# EAGLE design thefly (EAGLE 7.6.0)
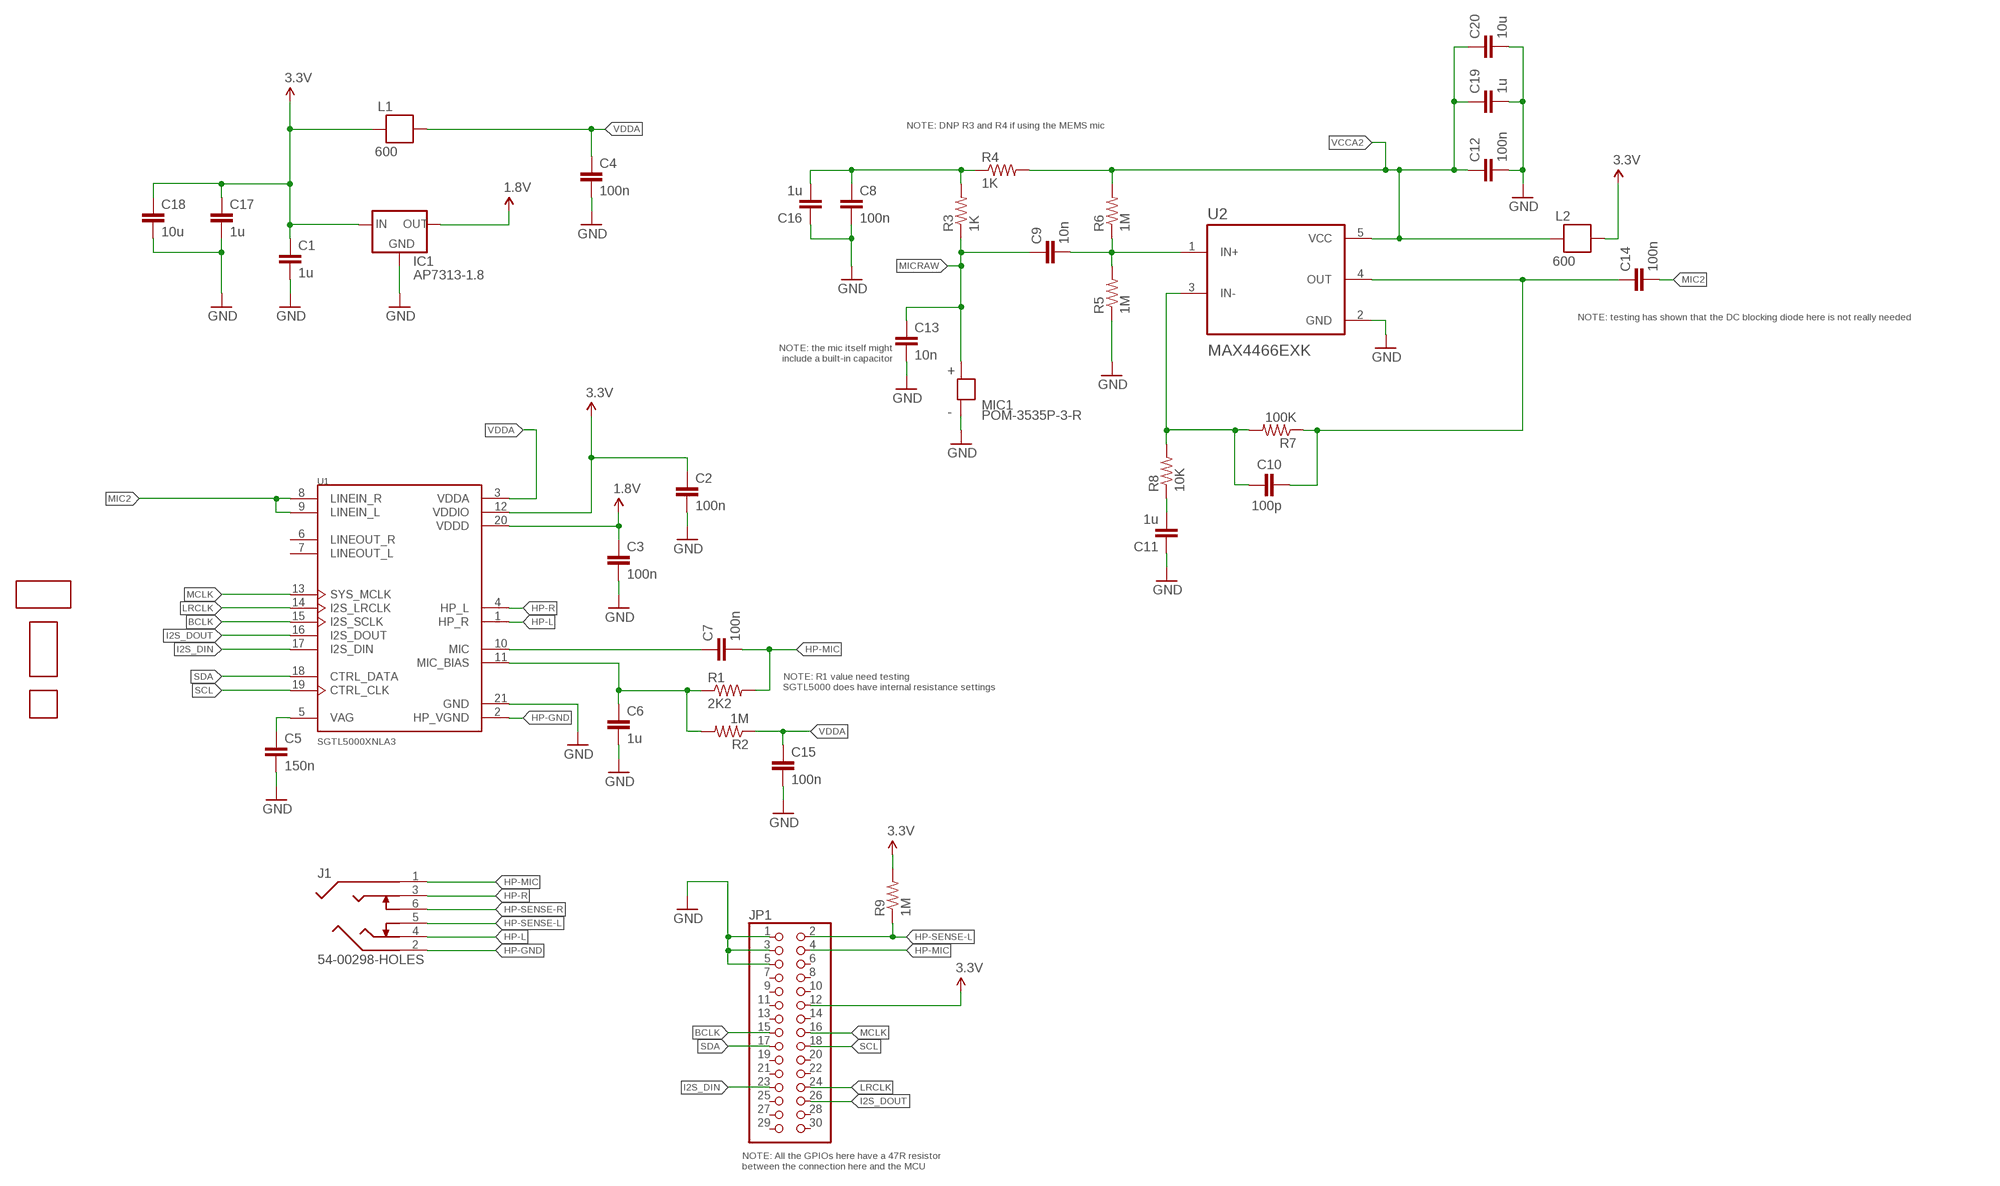
[diagram p0: schematic, sheet 1]

## Parts
C1  1u  CAP0603-CAP  [0603-CAP]
C2  100n  CAP0603-CAP  [0603-CAP]
C3  100n  CAP0603-CAP  [0603-CAP]
C4  100n  CAP0603-CAP  [0603-CAP]
C5  150n  CAP0603-CAP  [0603-CAP]
C6  1u  CAP0603-CAP  [0603-CAP]
C7  100n  CAP0603-CAP  [0603-CAP]
C8  100n  CAP0603-CAP  [0603-CAP]
C9  10n  CAP0603-CAP  [0603-CAP]
C10  100p  CAP0603-CAP  [0603-CAP]
C11  1u  CAP0603-CAP  [0603-CAP]
C12  100n  CAP0603-CAP  [0603-CAP]
C13  10n  CAP0603-CAP  [0603-CAP]
C14  100n  CAP0603-CAP  [0603-CAP]
C15  100n  CAP0603-CAP  [0603-CAP]
C16  1u  CAP0603-CAP  [0603-CAP]
C17  1u  CAP0603-CAP  [0603-CAP]
C18  10u  CAP0603-CAP  [0603-CAP]
C19  1u  CAP0603-CAP  [0603-CAP]
C20  10u  CAP0603-CAP  [0603-CAP]
IC1  AP7313-1.8  V_REG_78XX-SOT23-3  [SOT23-3]
J1  54-00298-HOLES  [TENSILITY_54-00298_HOLES]
JP1  PINHD-2X15-SMD-R  [2X15-SMD-R]
L1  600  FB  [0603]
L2  600  FB  [0603]
MIC1  POM-3535P-3-R  [MIC_POM-3535P-3-R]
R1  2K2  RESISTOR0603-RES  [0603-RES]
R2  1M  RESISTOR0603-RES  [0603-RES]
R3  1K  RESISTOR0603-RES  [0603-RES]
R4  1K  RESISTOR0603-RES  [0603-RES]
R5  1M  RESISTOR0603-RES  [0603-RES]
R6  1M  RESISTOR0603-RES  [0603-RES]
R7  100K  RESISTOR0603-RES  [0603-RES]
R8  10K  RESISTOR0603-RES  [0603-RES]
R9  1M  RESISTOR0603-RES  [0603-RES]
U1  SGTL5000XNLA3  [QFN40P300X300X60-21N]
U2  MAX4466EXK  [SOT65P210X110-5N]
U$1  M5STACK-CORE2-DAUGHTER  [M5STACK-CORE2-DAUGHTER]
U$2  M5STACK-BATT-OUTLINE  [M5STACK-BATT-OUTLINE]
U$5  THE-FLY-LOGO  [THE-FLY-LOGO]

## Nets
1.8V: C3.1 IC1.2(OUT) U1.20(VDDD)
3.3V: C1.1 C2.1 C17.1 C18.1 IC1.1(IN) JP1.12 L1.2 L2.1 R9.2 U1.12(VDDIO)
ASDASDASD: C10.2 C14.1 R7.1 U2.4(OUT)
BCLK: JP1.15 U1.15(I2S_SCLK)
GND: C1.2 C2.2 C3.2 C4.2 C5.2 C6.2 C8.2 C11.1 C12.2 C13.2 C15.2 C16.1 C17.2 C18.2 C19.2 C20.2 IC1.3(GND) JP1.1 JP1.3 JP1.5 MIC1.N(-) R5.1 U1.21(GND) U2.2(GND)
HP-GND: J1.2 U1.2(HP_VGND)
HP-L: J1.4 U1.1(HP_R)
HP-MIC: C7.2 J1.1 JP1.4 R1.2
HP-R: J1.3 U1.4(HP_L)
HP-SENSE-L: J1.5 JP1.2 R9.1
HP-SENSE-R: J1.6
I2S_DIN: JP1.23 U1.17(I2S_DIN)
I2S_DOUT: JP1.26 U1.16(I2S_DOUT)
LRCLK: JP1.24 U1.14(I2S_LRCLK)
MCLK: JP1.16 U1.13(SYS_MCLK)
MIC2: C14.2 U1.8(LINEIN_R) U1.9(LINEIN_L)
MICRAW: C9.1 C13.1 MIC1.P(+) R3.1
N$3: C5.1 U1.5(VAG)
N$4: C6.1 R1.1 R2.2 U1.11(MIC_BIAS)
N$5: C7.1 U1.10(MIC)
N$6: C10.1 R7.2 R8.2 U2.3(IN-)
N$8: C11.2 R8.1
N$9: C9.2 R5.2 R6.1 U2.1(IN+)
N$11: C8.1 C16.2 R3.2 R4.1
SCL: JP1.18 U1.19(CTRL_CLK)
SDA: JP1.17 U1.18(CTRL_DATA)
VCCA2: C12.1 C19.1 C20.1 L2.2 R4.2 R6.2 U2.5(VCC)
VDDA: C4.1 C15.1 L1.1 R2.1 U1.3(VDDA)
Unconnected: JP1.6 JP1.7 JP1.8 JP1.9 JP1.10 JP1.11 JP1.13 JP1.14 JP1.19 JP1.20 JP1.21 JP1.22 JP1.25 JP1.27 JP1.28 JP1.29 JP1.30 U1.6(LINEOUT_R) U1.7(LINEOUT_L)

## Notes on the sheet
- NOTE: DNP R3 and R4 if using the MEMS mic
- NOTE: testing has shown that the DC blocking diode here is not really needed
- NOTE: the mic itself might
  include a built-in capacitor
- NOTE: R1 value need testing
  SGTL5000 does have internal resistance settings
- NOTE: All the GPIOs here have a 47R resistor
  between the connection here and the MCU

## Library data of the parts
C1-C20 = thefly:CAP: Capacitor Standard 0603 ceramic capacitor, and 0.1" leaded capacitor.
IC1 = thefly:V_REG_78XX: Voltage Regulator Standard 7805 5V regulator. IGO (Input Ground Output). Spark Fun Electronics SKU : COM-00107
J1 = thefly:54-00298
JP1 = thefly:PINHD-2X15: PIN HEADER
L1 L2 = thefly:FB
MIC1 = thefly:POM-3535P-3-R; CHECK_PRICES: https://www.snapeda.com/parts/POM-3535P-3-R/PUI+Audio/view-part/?ref=eda; DESCRIPTION: 6MM ECM MIC 20~20000HZ 35DB 2V 0.5MA IP52 OMNIDIRECTIONAL; DIGIKEY_PART_NUMBER: 668-1425-ND; MF: PUI Audio; MP: POM-3535P-3-R; PACKAGE: None; SNAPEDA_LINK: https://www.snapeda.com/parts/POM-3535P-3-R/PUI+Audio/view-part/?ref=snap
R1-R9 = thefly:RESISTOR: Resistor Basic schematic elements and footprints for 0603, 1206, and PTH resistors.
U1 = thefly:SGTL5000XNLA3: Check availability <https://pricing.snapeda.com/parts/SGTL5000XNLA3/NXP%20Semiconductors/view-part?ref=eda>; AVAILABILITY: In Stock; CHECK_PRICES: https://www.snapeda.com/parts/SGTL5000XNLA3/NXP+Semiconductors/view-part/?ref=eda; DESCRIPTION: Stereo Audio Interface - I²C, Serial, SPI™ 20-QFN-EP (3x3); MF: NXP Semiconductors; MP: SGTL5000XNLA3; PACKAGE: QFN-20 Freescale Semiconductor; PRICE: None; PURCHASE-URL: https://www.snapeda.com/api/url_track_click_mouser/?unipart_id=4792388&manufacturer=NXP Semiconductors&part_name=SGTL5000XNLA3&search_term=sgtl5000; SNAPEDA_LINK: https://www.snapeda.com/parts/SGTL5000XNLA3/NXP+Semiconductors/view-part/?ref=snap
U2 = thefly:MAX4466EXK; CHECK_PRICES: https://www.snapeda.com/parts/MAX4466EXK+T/Maxim+Integrated/view-part/?ref=eda; DESCRIPTION: Audio Amp Microphone 1-CH Mono Class-AB 5-Pin SC-70 T/R; DIGIKEY_PART_NUMBER: MAX4466EXK+CT-ND; MF: Maxim Integrated Products; MP: MAX4466EXK+T; PACKAGE: SC-70-5 Maxim; PURCHASE-URL: https://www.snapeda.com/api/url_track_click_mouser/?unipart_id=13771026&manufacturer=Maxim Integrated Products&part_name=MAX4466EXK+T&search_term=max4466; SNAPEDA_LINK: https://www.snapeda.com/parts/MAX4466EXK+T/Maxim+Integrated/view-part/?ref=snap
U$1 = thefly:M5STACK-CORE2-DAUGHTER
U$2 = thefly:M5STACK-BATT-OUTLINE
U$5 = thefly:THE-FLY-LOGO

## Board
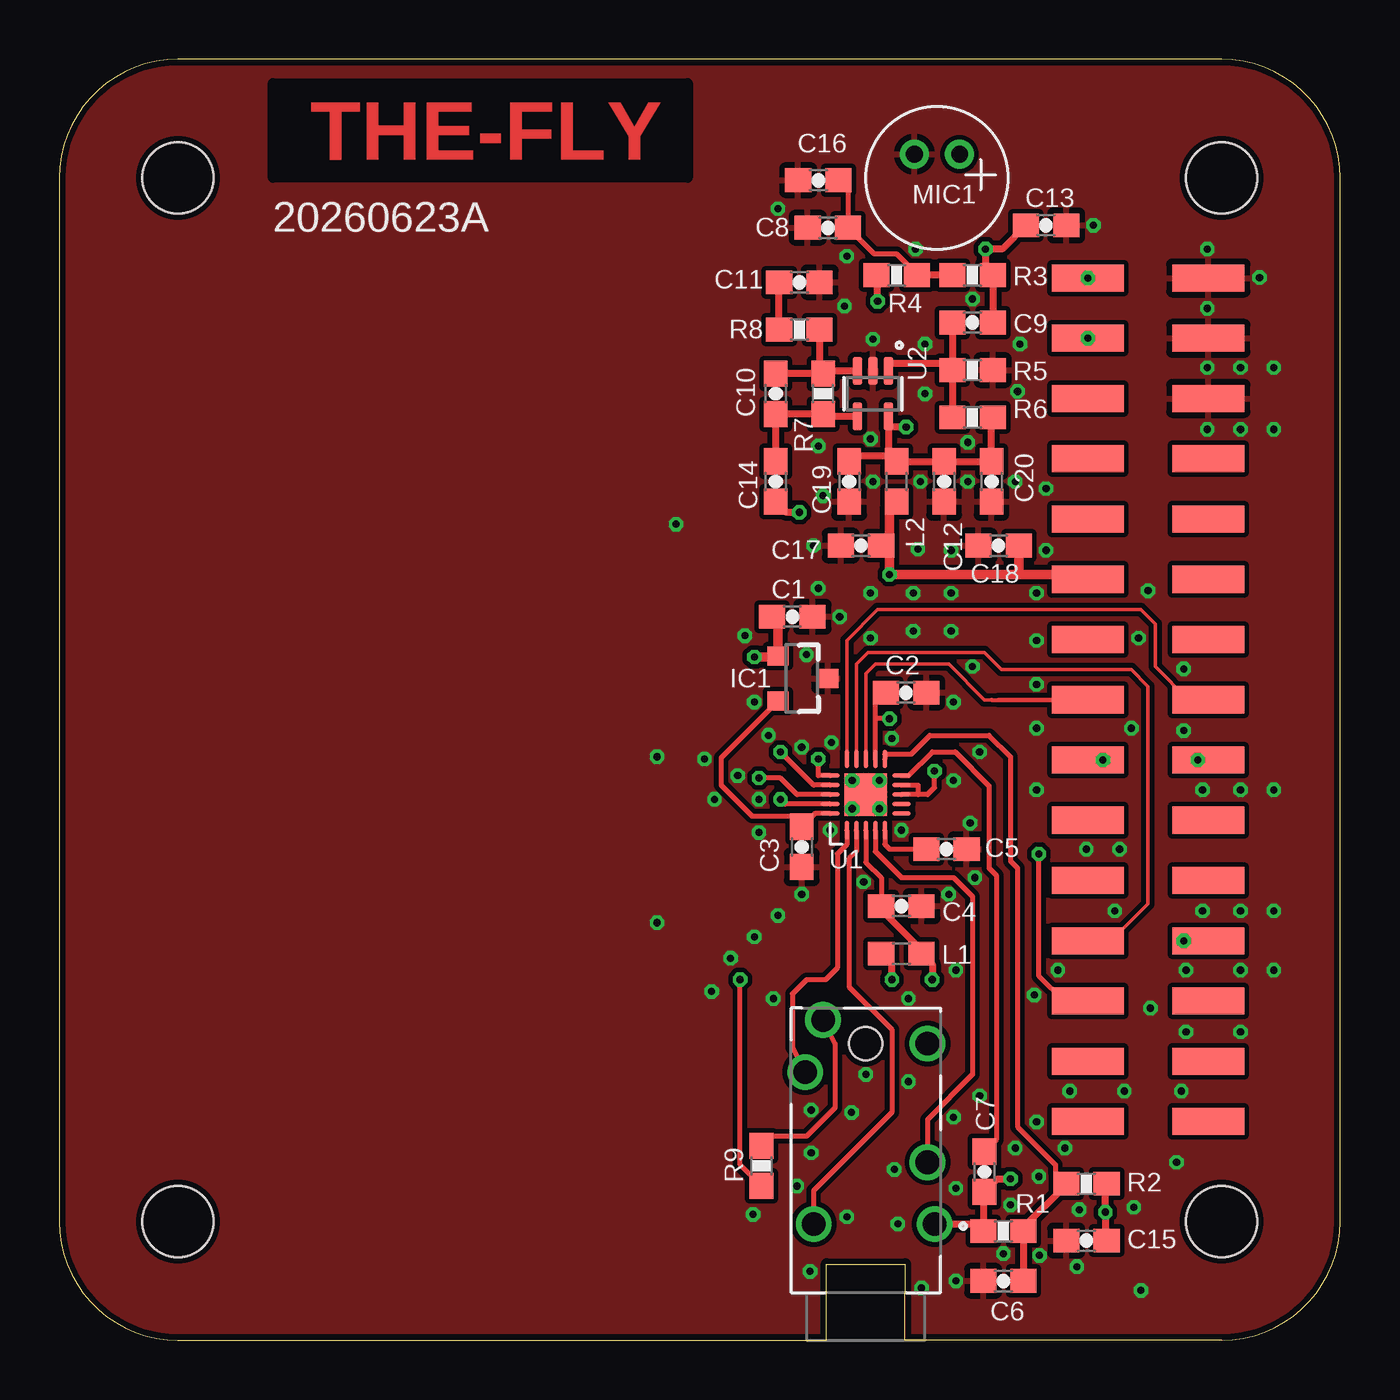
[diagram p1: board, top side]
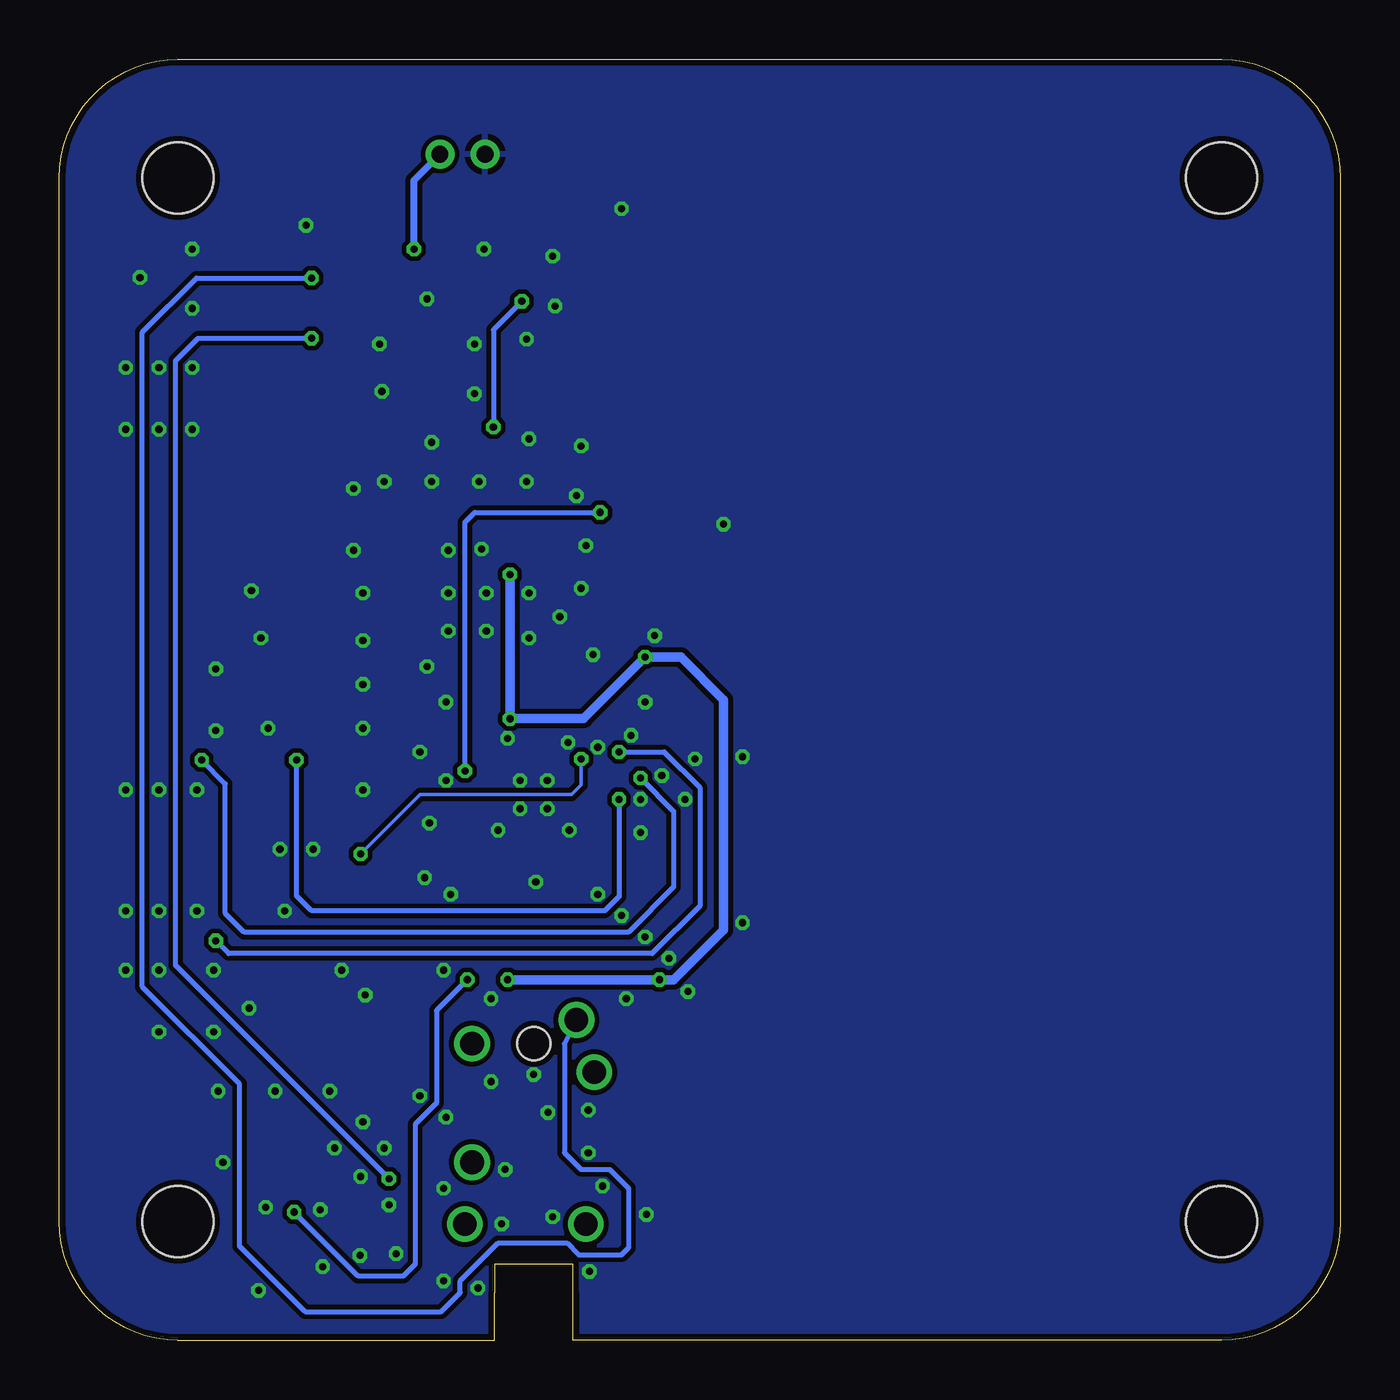
[diagram p2: board, bottom side, seen from below]

Size 54 x 54 mm. Coordinates in mm from the lower left corner, seen from the top.
Outline: 5,0 32.35,0 32.35,2
Outline: 49,0 35.65,0 35.65,2
Copper layers (1*16): Top 0.035mm / dielectric 1.5mm / Bottom 0.035mm
Design rules "fusion-eagle-rule-tentedvias": minimum track width 6mil, minimum drill 0.3mm, track to track 6mil, track to pad 6mil, pad to pad 6mil, via to via 6mil, smd to smd 0mil, copper to edge 10mil, drill to drill 10mil, minimum pad ring 10mil, minimum via ring 6mil, stop-mask expansion 2mil, vias tented up to drill 25mil, thermal gap 10mil

### Footprints (pad centres in the part's own frame; a part is rotated, then mirrored left to right if it is on the bottom)
0603-CAP = smd 1.1 x 1: 1 -0.85,0; 2 0.85,0
SOT23-3 = smd 0.8 x 0.9: 1 -0.95,-1; 2 0.95,-1; 3 0,1.1
TENSILITY_54-00298_HOLES = drill 1: 1 2.9,-2.1; 2 -2.2,-2.1; 3 2.6,0.5; 4 -2.55,4.3; 5 -1.8,6.5; 6 2.6,5.5 | hole 1.4: 0,5.5
2X15-SMD-R = smd 1.143 x 3.048: 1 -17.78,2.54; 2 -17.78,-2.54; 3 -15.24,2.54; 4 -15.24,-2.54; 5 -12.7,2.54; 6 -12.7,-2.54; 7 -10.16,2.54; 8 -10.16,-2.54; 9 -7.62,2.54; 10 -7.62,-2.54; 11 -5.08,2.54; 12 -5.08,-2.54; 13 -2.54,2.54; 14 -2.54,-2.54; 15 0,2.54; 16 0,-2.54; 17 2.54,2.54; 18 2.54,-2.54; 19 5.08,2.54; 20 5.08,-2.54; 21 7.62,2.54; 22 7.62,-2.54; 23 10.16,2.54; 24 10.16,-2.54; 25 12.7,2.54; 26 12.7,-2.54; 27 15.24,2.54; 28 15.24,-2.54; 29 17.78,2.54; 30 17.78,-2.54
0603 = smd 1.1 x 1: 1 -0.85,0; 2 0.85,0
MIC_POM-3535P-3-R = drill 0.7: N -0.95,1; P 0.95,1
0603-RES = smd 1.1 x 1: 1 -0.85,0; 2 0.85,0
QFN40P300X300X60-21N = smd 0.8 x 0.2: 1 -1.5,0.8; 2 -1.5,0.4; 3 -1.5,0; 4 -1.5,-0.4; 5 -1.5,-0.8; 11 1.5,-0.8; 12 1.5,-0.4; 13 1.5,0; 14 1.5,0.4; 15 1.5,0.8 | smd 0.2 x 0.8: 6 -0.8,-1.5; 7 -0.4,-1.5; 8 0,-1.5; 9 0.4,-1.5; 10 0.8,-1.5; 16 0.8,1.5; 17 0.4,1.5; 18 0,1.5; 19 -0.4,1.5; 20 -0.8,1.5 | smd 1.8 x 1.8: 21 0,0
SOT65P210X110-5N = smd 1.19 x 0.4: 1 -0.96,0.65; 2 -0.96,0; 3 -0.96,-0.65; 4 0.96,-0.65; 5 0.96,0.65
M5STACK-CORE2-DAUGHTER = hole 3: 5,5; 49,5; 49,49; 5,49

### Placement (x,y rotation side)
C1  30.9,30.5 0 top
C2  35.7,27.3 0 top
C3  31.3,20.8 270 top
C4  35.5,18.3 0 top
C5  37.4,20.7 0 top
C6  39.8,2.5 180 top
C7  39,7.1 270 top
C8  32.4,46.9 180 top
C9  38.5,42.9 180 top
C10  30.2,39.9 270 top
C11  31.2,44.6 180 top
C12  37.3,36.2 270 top
C13  41.6,47 0 top
C14  30.2,36.2 270 top
C15  43.3,4.2 180 top
C16  32,48.9 0 top
C17  33.8,33.5 180 top
C18  39.6,33.5 180 top
C19  33.3,36.2 270 top
C20  39.3,36.2 270 top
IC1  31.3,27.9 270 top
J1  34,7 0 top
JP1  45.9,27 270 top
L1  35.5,16.3 180 top
L2  35.3,36.2 90 top
MIC1  37,49 0 top
R1  39.8,4.6 180 top
R2  43.3,6.6 180 top
R3  38.5,44.9 180 top
R4  35.3,44.9 180 top
R5  38.5,40.9 180 top
R6  38.5,38.9 0 top
R7  32.2,39.9 90 top
R8  31.2,42.6 0 top
R9  29.6,7.35 270 top
U1  34,23 90 top
U2  34.3,39.9 270 top
U$1  0,0 0 top
U$2  4,9 0 top
U$5  18,51 0 top

### Tracks (layer width: path | path; a pad name or v marks a point on that pad's centre or on a via)
1.8V
  Top 0.203: U1.20 31.85,22.2 C3.1 | 31.25,21.6 C3.1 | IC1.2 27.9,24.55 27.9,23.4 29.2,22.1 31.3,22.1 C3.1
3.3V  (via drill 0.3)
  Top 0.203: U1.12 34.4,26.2 | C2.1 34.4,26.85 34.4,26.2 | v35,26.2 34.4,26.2 | R9.2 28.7,7.4 v28.7,15.2
  Top 0.305: v35.1,15.2 35.1,15.85 L1.2
  Top 0.406: v29.3,28.8 30.25,28.8 IC1.1 30.3,30.5 C1.1 | JP1.12 43.36,32.28 40.45,32.28 | 40.45,32.28 v35,32.28 35,33.5 | C18.1 40.45,32.28 | L2.1 35,35.05 35,34 35,33.5 | C17.1 35,33.5
  Bottom 0.406: v35.1,15.2 v28.7,15.2 28.1,15.2 26,17.3 26,27 27.8,28.8 v29.3,28.8 31.9,26.2 v35,26.2 v35,32.28
ASDASDASD
  Top 0.203: 32.21,38.94 R7.1
  Top 0.305: U2.4 32.21,38.94 | R7.1 C10.2 C14.1
BCLK
  Top 0.152: U1.15 33.2,29.5 34.5,30.8 45.6,30.8 46.2,30.2 46.2,28.4 47.6,27 JP1.15
GND  (via drill 0.3)
  Top 0.203: v34.58,22.41 34.58,23 U1.21
  other vias: 33.42,23.59 34.58,23.59 33.42,22.41 40.3,8.1 40.1,5.7 38.8,24.8 35.1,25.38 37.7,26.9 32.5,21.5 35.5,21.5 31.3,18.8 37.5,18.8 38.6,19.5 38.4,21.8 29.5,22.8 28.6,23.8 32.55,25.2 29.5,21.4 29.9,25.5 29.3,26.9 31.5,28.9 32.9,30.5 28.9,29.7 27.62,22.8 27.2,24.5 30.3,17.9 43.3,20.7 44.7,20.7 45.2,25.8 41.2,23.2 41.2,25.8 41.2,29.5 36,29.9 34.2,29.6 37.6,29.9 37.6,31.5 36,31.5 34.2,31.5 45.9,31.6 41.6,33.3 37.6,33.3 32,31.7 47.4,28.3 47.4,25.7 48.2,23.2 49.8,23.2 48.4,43.5 48.4,41 48.4,38.4 49.8,41 49.8,38.4 48.2,18.1 49.8,18.1 42.6,10.5 44.9,10.5 41.3,6.9 41.2,9.2 38.8,10.3 33.4,9.6 34,11.2 31.7,7.9 35.8,10.9 35.8,14.4 37.8,15.6 30.1,14.4 29.3,17 28.3,16.1 44.5,18.1 37.7,23.6 26,34.4 36.2,33.35 25.2,24.6 25.2,17.6 33.91,19.32 38.5,28.4 41.2,27.65 50.6,44.8 48.4,46 31.3,25 41.1,14.55 39.8,3.65 51.2,18.1 51.2,23.2 51.2,41 51.2,38.4 45.6,2.1 45.3,5.6 31.7,9.7 47.1,7.5 47.5,13 49.8,13 49.8,15.6 47.5,15.6 46,14 47.3,10.5 51.2,15.6 29.25,5.3 45.5,29.6 41.2,31.5 42.1,15.6 27.5,14.7 37.8,2.5 31.1,6.5 37.8,6.4 35.2,7.2 33.2,5.2 43,5.5 42.9,3.1 41.33,3.58 42.4,8.1 37.7,9.4 34.3,36.2 36.5,39.9 40.4,40 40.5,42 36.5,42 38.5,43.9 43.6,47 36.1,46 30.3,47.7 33.2,45.7 34.3,42.2 33.1,43.6 32,37.7 36.3,36.2 38.3,36.2 40.3,36.2 41.6,35.9 31.8,33.5 31.65,2.9 36.35,2.2 35.35,4.9 34.2,38 38.3,37.85 32.2,35.6
  pour Bottom (isolate 0.203, rank 5): 0,0 54,0 54,54 0,54
  pour Top (isolate 0.203, rank 5): 0,0 54,0 54,54 0,54
HP-GND
  Top 0.203: U1.2 33.6,20.6 33.3,20.3 33.3,14.9 35.1,13.1 35.1,9.6 31.8,6.3 J1.2
HP-L
  Top 0.203: U1.1 33.2,20.9 32.8,20.5 32.8,15.7 32.3,15.2 31.5,15.2 30.9,14.6 30.9,12.35 J1.4
HP-MIC  (via drill 0.3)
  Top 0.203: C7.2 38.95,6.25
  Top 0.305: 38.95,6.25 R1.2 38.65,4.9 J1.1 | C7.2 39.55,6.8 v40.1,6.8
  Bottom 0.203: v40.1,6.8 49.1,15.8 49.1,41.3 48.16,42.24 JP1.4
  other vias: 43.36,42.24
HP-R
  Top 0.203: U1.4 34.4,20.6 35.5,19.5 37.7,19.5 38.5,18.7 38.5,11.2 36.6,9.3 J1.3
HP-SENSE-L  (via drill 0.3)
  Top 0.203: R9.1 30,8.6 31.5,8.6 32.7,9.8 32.7,12.5 J1.5
  Bottom 0.203: J1.5 32.7,12.5 32.7,7.9 32,7.2 30.8,7.2 30,6.4 30,3.9 30.3,3.6 32.1,3.6 32.6,4.1 35.5,4.1 37.1,2.5 37.1,2 37.9,1.2 43.63,1.2 46.4,3.97 46.4,10.8 50.5,14.9 50.5,42.5 48.22,44.78 JP1.2
  other vias: 43.36,44.78
I2S_DIN  (via drill 0.3)
  Top 0.203: U1.17 31.8,23.4 v30.4,24.8 | v47.4,16.84 JP1.23
  Bottom 0.203: v30.4,24.8 28.5,24.8 27,23.3 27,18.3 29,16.3 46.86,16.3 v47.4,16.84
I2S_DOUT  (via drill 0.3)
  Top 0.203: JP1.26 42.34,14.3 41.3,15.34 v41.3,20.5 | U1.16 32,23.8 v32,24.5
  Bottom 0.152: v41.3,20.5 38.8,23 32.4,23 32,23.4 v32,24.5
LRCLK
  Top 0.152: U1.14 33.6,28.5 34.1,29 39,29 39.73,28.27 45.19,28.27 45.9,27.56 45.9,18.4 44.34,16.84
  Top 0.203: JP1.24 44.34,16.84
MCLK
  Top 0.152: U1.13 34,28.1 34.4,28.5 37.5,28.5 39,27 39.3,27
  Top 0.17: 39.3,27 39.6,27
  Top 0.2: 39.6,27 JP1.16
MIC2  (via drill 0.3)
  Top 0.203: v36.9,24 36.9,23.3 36.6,23 36.2,23 | U1.9 36.2,23.4 36.2,23 | 36.2,23 U1.8
  Top 0.305: v31.2,34.9 30.65,34.9 C14.2
  Bottom 0.203: v36.9,24 36.9,34.49 36.49,34.9 v31.2,34.9
MICRAW  (via drill 0.3)
  Top 0.305: C9.1 R3.1 39.05,45.2 v39.05,46 39.75,46 C13.1
  Bottom 0.305: v39.05,46 39.05,48.9 MIC1.P
N$3
  Top 0.203: U1.5 34.8,20.9 35,20.7 C5.1
N$4
  Top 0.203: R2.2 42,7.05 42,7.4 40.4,9 40.4,19.9 40.1,20.2 40.1,24.6 39.2,25.5 36.7,25.5 35.9,24.7 34.8,24.7 U1.11
  Top 0.305: C6.1 R1.1 40.65,4.75 42.45,6.55 R2.2
N$5
  Top 0.203: U1.10 35.8,23.8 36.8,24.8 37.77,24.8 39.2,23.37 39.2,19.9 39.5,19.6 39.5,8.45 C7.1
N$6
  Top 0.203: 32.31,40.86 R7.2 32.05,40.9
  Top 0.305: U2.3 32.31,40.86 | R7.2 C10.1 | R8.2 32.05,40.9
N$8
  Top 0.305: R8.1 C11.2
N$9
  Top 0.203: 37.65,41.2 R5.2
  Top 0.305: C9.2 R5.2 R6.1 | U2.1 34.95,41.2 37.65,41.2
N$11
  Top 0.203: C16.2 33.25,48.5 C8.1 34.35,45.8 35.3,45.8 36.15,44.95 R4.1
  Top 0.305: R3.2 R4.1
SCL  (via drill 0.3)
  Top 0.203: U1.19 30.6,22.6 v30.4,22.8 | v44,24.46 JP1.18
  Bottom 0.203: v30.4,22.8 30.4,18.71 31.01,18.1 43.36,18.1 44,18.74 v44,24.46
SDA  (via drill 0.3)
  Top 0.203: U1.18 31.1,23 30.4,23.7 v29.5,23.7 | v48,24.46 JP1.17
  Bottom 0.203: v29.5,23.7 28.1,22.3 28.1,19.11 30.01,17.2 46.2,17.2 47,18 47,23.46 v48,24.46
VCCA2  (via drill 0.3)
  Top 0.203: 34.95,37.4 L2.2 35.3,37.3 | 34.95,38.5 U2.5 | 34.5,44.9 R4.2 | C19.1 33.55,37.3
  Top 0.305: U2.5 34.95,37.4 | L2.2 C12.1 C20.1 39.3,38.85 R6.2 39.3,38.9 | v35.7,38.5 34.95,38.5 | v34.5,43.8 34.5,44.9 | 33.55,37.3 35.3,37.3
  Bottom 0.203: v34.5,43.8 35.7,42.6 v35.7,38.5
VDDA  (via drill 0.3)
  Top 0.203: U1.3 34,20.15 34.65,19.5 C4.1 | 44.1,6.55 R2.1 | 44.1,4.35 C15.1
  Top 0.305: 44.15,6.45 R2.1 | C4.1 34.65,18.15 36.35,16.45 L1.1 36.8,15.85 v36.8,15.2 | 44.1,6.55 v44.1,5.4 44.1,4.35
  Bottom 0.203: v36.8,15.2 38.1,13.9 38.1,10 39,9.1 39,3.2 39.5,2.7 41.4,2.7 v44.1,5.4

### Text on the board
tPlace: 20260623A